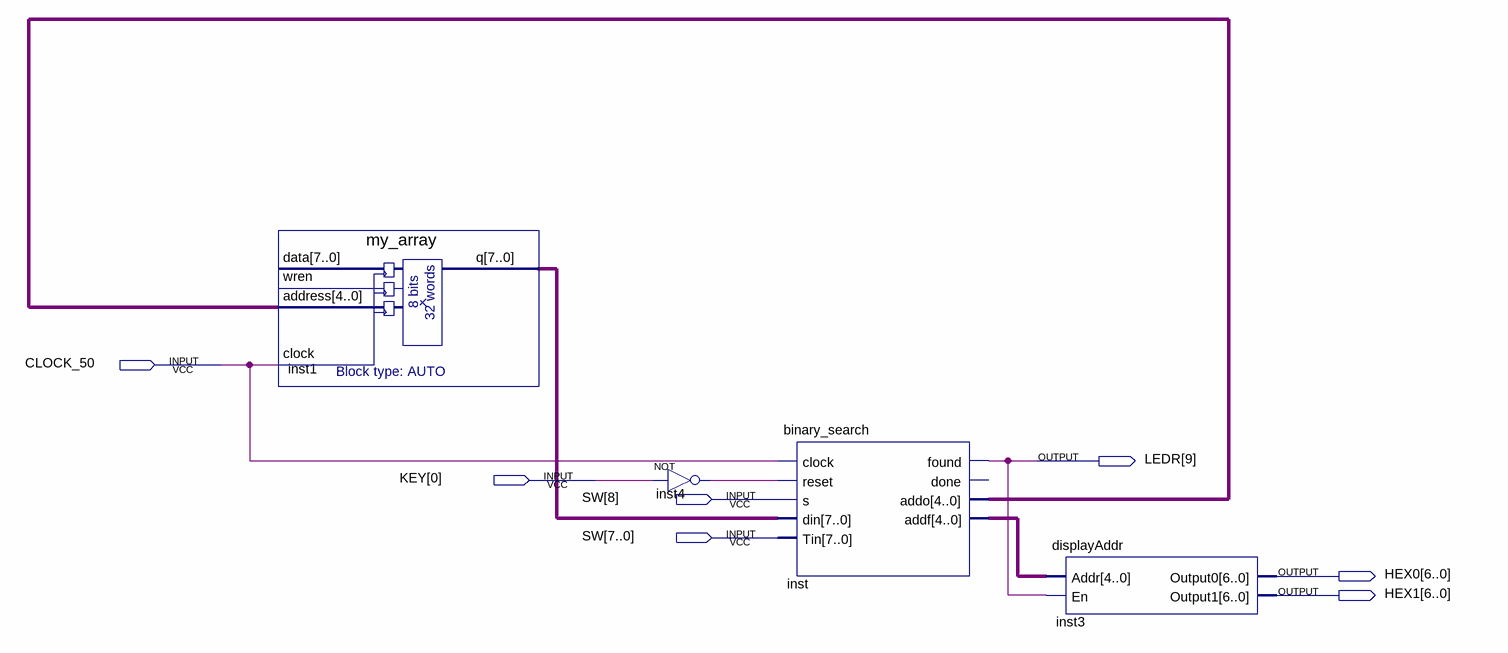
[diagram p0: schematic sheet]
// Quartus schematic Lab11Part2_Tested.bdf as structural Verilog: 4 symbols, 7 pins
module Lab11Part2_Tested (
  input  CLOCK_50,
  input  [0:0] KEY,
  input  [8:0] SW,
  output [9:9] LEDR,
  output [6:0] HEX0,
  output [6:0] HEX1
);

  wire inst4_out;
  wire [4:0] inst_addf, inst_addo;
  wire [7:0] inst1_q;

  my_array inst1 (.address(inst_addo), .clock(CLOCK_50), .q(inst1_q));  // open: data, wren
  not inst4 (inst4_out, KEY[0]);
  binary_search inst (
    .clock(CLOCK_50), .reset(inst4_out), .s(SW[8]), .din(inst1_q), .Tin(SW[7:0]), .found(LEDR[9]),
    .addo(inst_addo), .addf(inst_addf));  // open: done
  displayAddr inst3 (.Addr(inst_addf), .En(LEDR[9]), .Output0(HEX0), .Output1(HEX1));
endmodule
